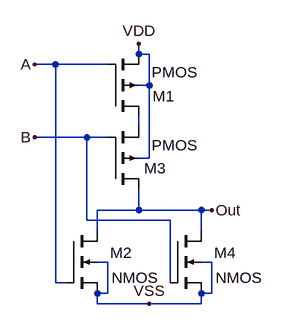
[diagram p0: schematic NOR.asc]
NOR.asc, the LTspice schematic file:
Version 4
SHEET 1 880 680
WIRE 368 16 368 0
WIRE 384 16 368 16
WIRE 240 32 208 32
WIRE 320 32 240 32
WIRE 384 64 384 16
WIRE 384 64 368 64
WIRE 368 128 368 112
WIRE 288 144 208 144
WIRE 320 144 288 144
WIRE 384 176 384 64
WIRE 384 176 368 176
WIRE 368 256 368 224
WIRE 368 256 304 256
WIRE 464 256 368 256
WIRE 480 256 464 256
WIRE 288 272 288 144
WIRE 416 272 288 272
WIRE 304 288 304 256
WIRE 464 288 464 256
WIRE 320 336 304 336
WIRE 480 336 464 336
WIRE 240 368 240 32
WIRE 256 368 240 368
WIRE 416 368 416 272
WIRE 320 384 320 336
WIRE 320 384 304 384
WIRE 480 384 480 336
WIRE 480 384 464 384
WIRE 304 400 304 384
WIRE 384 400 304 400
WIRE 464 400 464 384
WIRE 464 400 384 400
FLAG 384 400 VSS
FLAG 368 0 VDD
FLAG 480 256 Out
FLAG 208 32 A
FLAG 208 144 B
SYMBOL pmos4 320 112 M180
WINDOW 3 68 68 Left 2
WINDOW 0 69 31 Left 2
SYMATTR InstName M1
SYMATTR Value2 l=500n w=2u
SYMBOL nmos4 256 288 R0
WINDOW 3 70 72 Left 2
WINDOW 0 68 34 Left 2
SYMATTR InstName M2
SYMBOL pmos4 320 224 M180
WINDOW 3 68 68 Left 2
SYMATTR InstName M3
SYMATTR Value2 l=500n w=2u
SYMBOL nmos4 416 288 R0
WINDOW 3 70 72 Left 2
WINDOW 0 68 34 Left 2
SYMATTR InstName M4

The netlist it stands for:
* NOR.asc
M1 N001 A VDD VDD PMOS l=500n w=2u
M2 Out A VSS VSS NMOS
M3 Out B N001 VDD PMOS l=500n w=2u
M4 Out B VSS VSS NMOS
.model NMOS NMOS
.model PMOS PMOS
.lib standard.mos
.backanno
.end